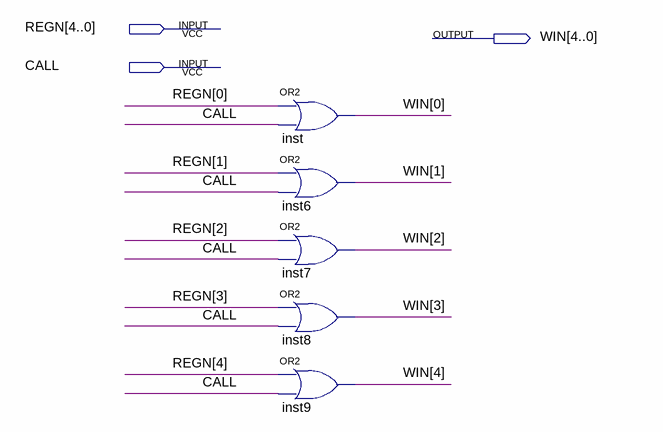
[diagram p0: schematic sheet]
// Quartus schematic f.bdf as structural Verilog: 5 symbols, 3 pins
module f (
  input  [4:0] REGN,
  input  CALL,
  output [4:0] WIN
);

  or inst (WIN[0], REGN[0], CALL);
  or inst6 (WIN[1], REGN[1], CALL);
  or inst7 (WIN[2], REGN[2], CALL);
  or inst8 (WIN[3], REGN[3], CALL);
  or inst9 (WIN[4], REGN[4], CALL);
endmodule
